# Altium project Isolator-Magnetic.PrjPcb
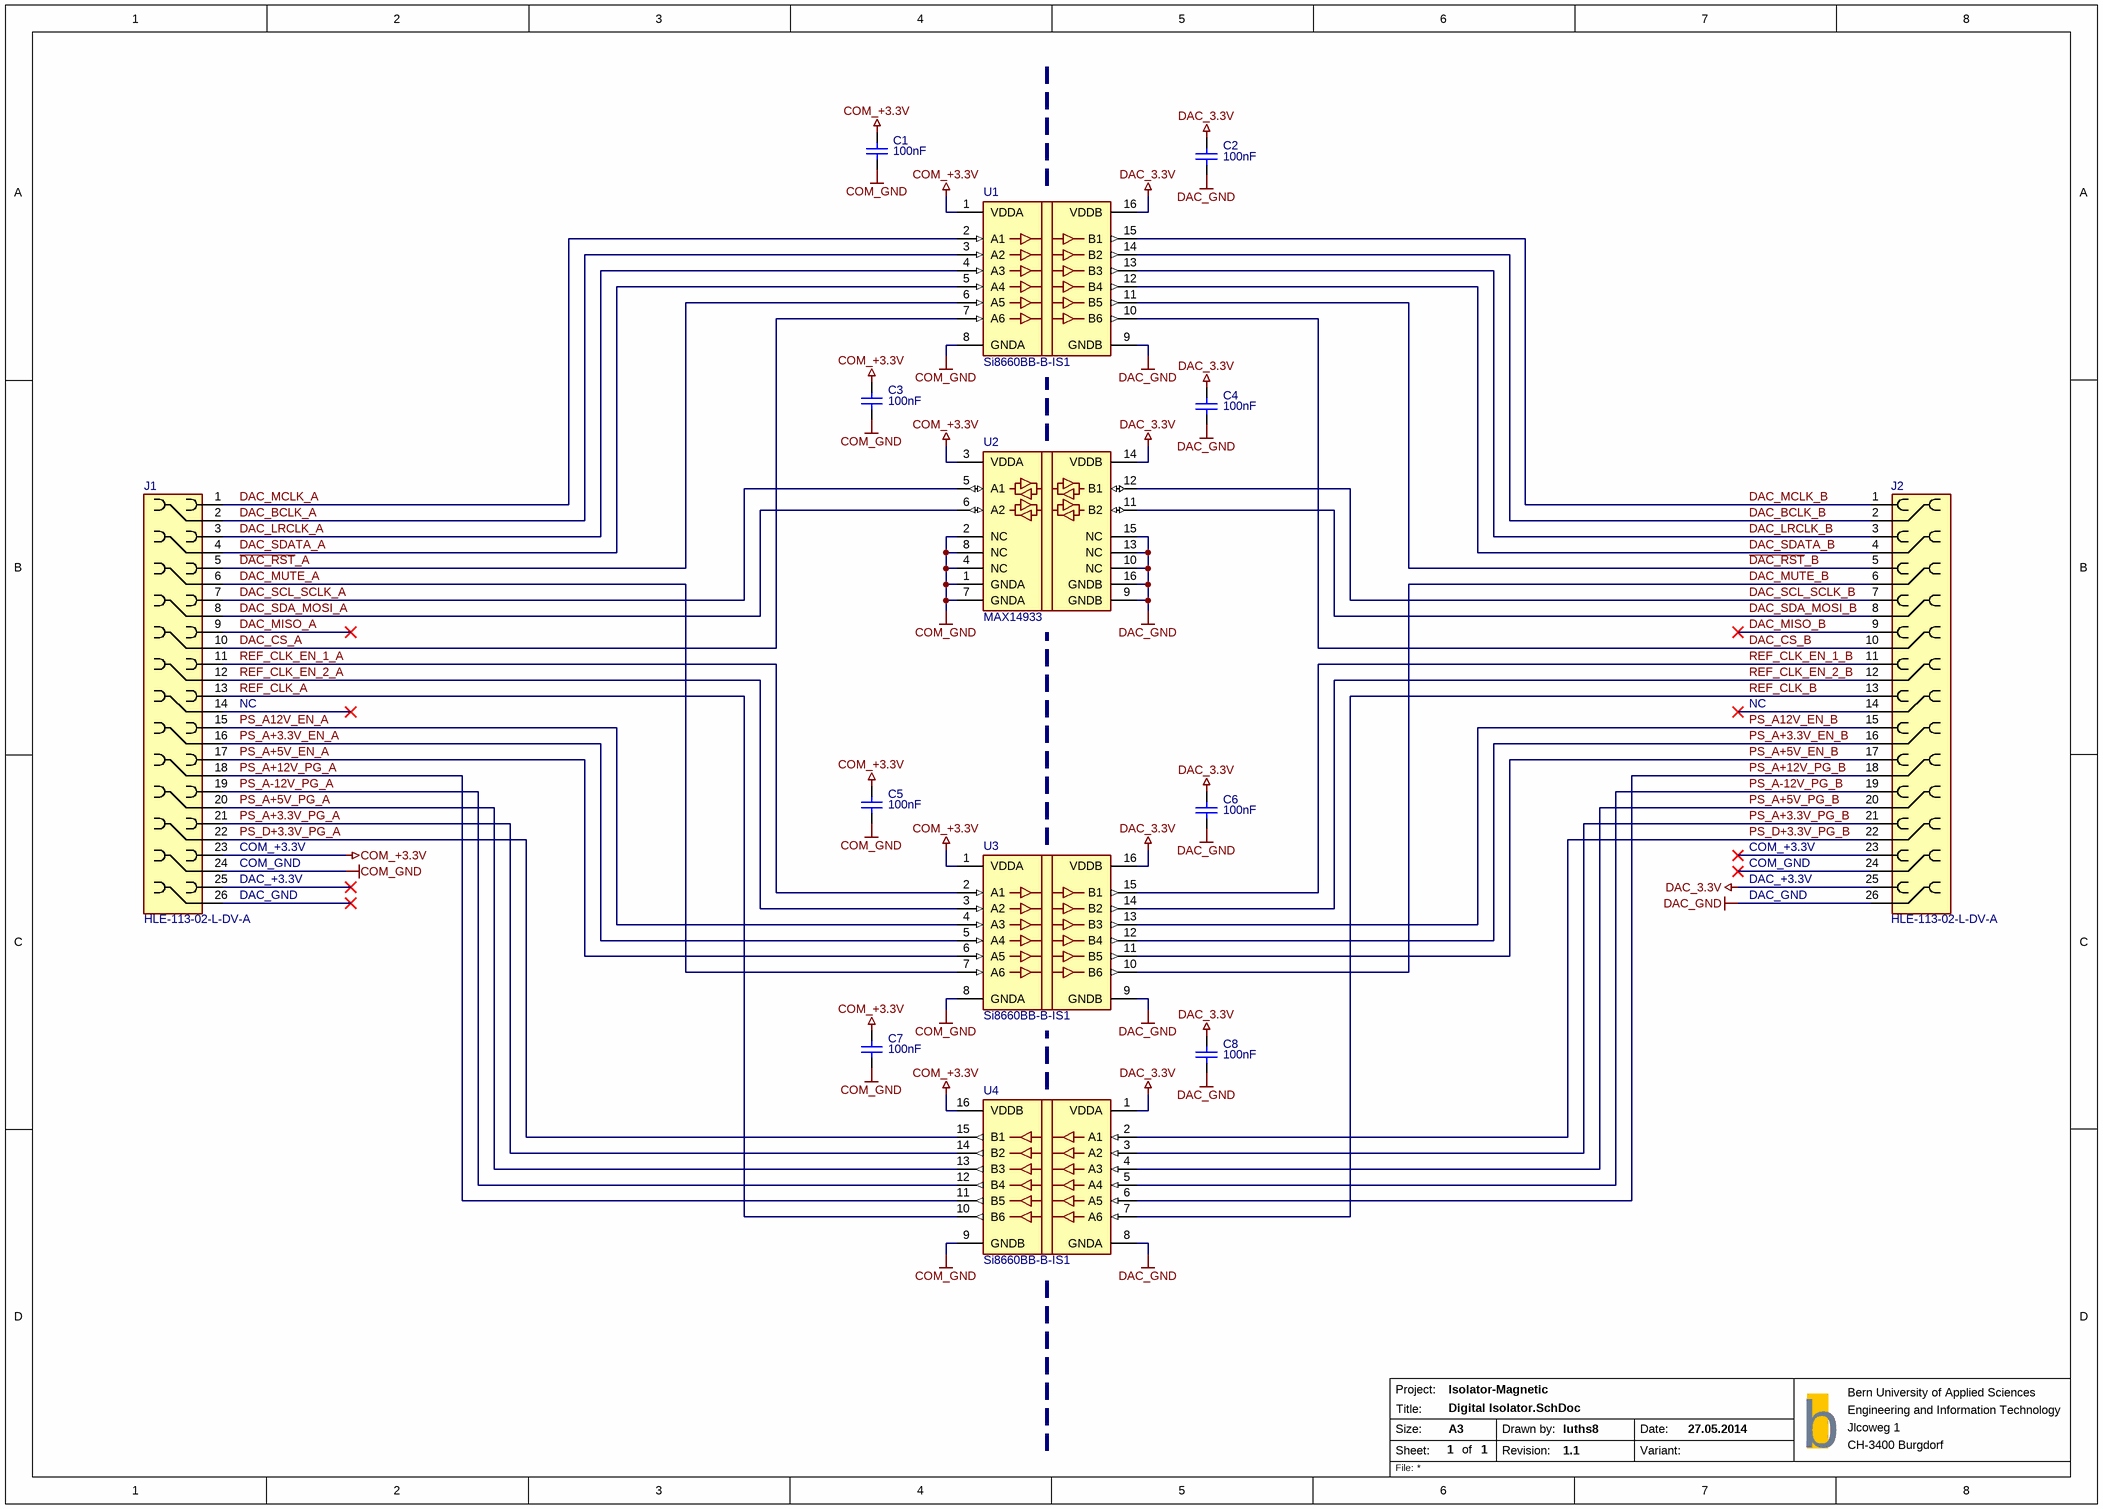
[diagram p0: Digital Isolator.SchDoc]
ProjectAuthors: Klossner, Lüthi; ProjectName: Isolator-Magnetic; Revision: 1.1
1 sheet, 14 parts. Net scope: hierarchical (ports join the sheet entries above them; power ports are global).
Board file: Isolator-Magnetic.PcbDoc

## Sheet Digital Isolator.SchDoc
size A3; Date: 27.05.2014; DrawnBy: luths8; Organization: BFH; Address1: Bern University of Applied Sciences; Address2: Engineering and Information Technology; Address3: Jlcoweg 1; Address4: CH-3400 Burgdorf; DocumentNumber: 1; Revision: 1.1; SheetNumber: 1; SheetTotal: 1; CurrentDate: 27.05.2014

### Parts
C1  100nF  [SMD0603CAP]
C2  100nF  [SMD0603CAP]
C3  100nF  [SMD0603CAP]
C4  100nF  [SMD0603CAP]
C5  100nF  [SMD0603CAP]
C6  100nF  [SMD0603CAP]
C7  100nF  [SMD0603CAP]
C8  100nF  [SMD0603CAP]
J1  HLE-113-02-L-DV-A  [HLE-113-02-XXX-DV-A]
J2  HLE-113-02-L-DV-A  [HLE-113-02-XXX-DV-A]
U1  Si8660BB-B-IS1  [SOIC16]
U2  MAX14933  [SOIC16]
U3  Si8660BB-B-IS1  [SOIC16]
U4  Si8660BB-B-IS1  [SOIC16]

### Nets
COM_+3.3V: C1.1 C3.1 C5.1 C7.1 J1.23 U1.1(VDDA) U2.3(VDDA) U3.1(VDDA) U4.16(VDDB)
COM_GND: C1.2(q) C3.2(q) C5.2(q) C7.2(q) J1.24 U1.8(GNDA) U2.1(GNDA) U2.2(NC) U2.4(NC) U2.7(GNDA) U2.8(NC) U3.8(GNDA) U4.9(GNDB)
DAC_3.3V: C2.1 C4.1 C6.1 C8.1 J2.25 U1.16(VDDB) U2.14(VDDB) U3.16(VDDB) U4.1(VDDA)
DAC_GND: C2.2(q) C4.2(q) C6.2(q) C8.2(q) J2.26 U1.9(GNDB) U2.9(GNDB) U2.10(NC) U2.13(NC) U2.15(NC) U2.16(GNDB) U3.9(GNDB) U4.8(GNDA)
~{DAC_RST}_A: J1.5 U1.6(A5)
~{DAC_RST}_B: J2.5 U1.11(B5)
DAC_BCLK_A: J1.2 U1.3(A2)
DAC_BCLK_B: J2.2 U1.14(B2)
DAC_CS_A: J1.10 U1.7(A6)
DAC_CS_B: J2.10 U1.10(B6)
DAC_LRCLK_A: J1.3 U1.4(A3)
DAC_LRCLK_B: J2.3 U1.13(B3)
DAC_MCLK_A: J1.1 U1.2(A1)
DAC_MCLK_B: J2.1 U1.15(B1)
DAC_MISO_A: J1.9
DAC_MISO_B: J2.9
DAC_MUTE_A: J1.6 U3.7(A6)
DAC_MUTE_B: J2.6 U3.10(B6)
DAC_SCL_SCLK_A: J1.7 U2.5(A1)
DAC_SCL_SCLK_B: J2.7 U2.12(B1)
DAC_SDA_MOSI_A: J1.8 U2.6(A2)
DAC_SDA_MOSI_B: J2.8 U2.11(B2)
DAC_SDATA_A: J1.4 U1.5(A4)
DAC_SDATA_B: J2.4 U1.12(B4)
PS_A12V_EN_A: J1.15 U3.4(A3)
PS_A12V_EN_B: J2.15 U3.13(B3)
PS_A+3.3V_EN_A: J1.16 U3.5(A4)
PS_A+3.3V_EN_B: J2.16 U3.12(B4)
PS_A+3.3V_PG_A: J1.21 U4.14(B2)
PS_A+3.3V_PG_B: J2.21 U4.3(A2)
PS_A+5V_EN_A: J1.17 U3.6(A5)
PS_A+5V_EN_B: J2.17 U3.11(B5)
PS_A+5V_PG_A: J1.20 U4.13(B3)
PS_A+5V_PG_B: J2.20 U4.4(A3)
PS_A+12V_PG_A: J1.18 U4.11(B5)
PS_A+12V_PG_B: J2.18 U4.6(A5)
PS_A-12V_PG_A: J1.19 U4.12(B4)
PS_A-12V_PG_B: J2.19 U4.5(A4)
PS_D+3.3V_PG_A: J1.22 U4.15(B1)
PS_D+3.3V_PG_B: J2.22 U4.2(A1)
REF_CLK_A: J1.13 U4.10(B6)
REF_CLK_B: J2.13 U4.7(A6)
REF_CLK_EN_1_A: J1.11 U3.2(A1)
REF_CLK_EN_1_B: J2.11 U3.15(B1)
REF_CLK_EN_2_A: J1.12 U3.3(A2)
REF_CLK_EN_2_B: J2.12 U3.14(B2)

Not connected (* = marked no-connect by the designer): J1 14* 25* 26*; J2 14* 23* 24*

### Notes on the sheet
- (near J1) NC
- NC
- (near J1) COM_+3.3V
- COM_+3.3V
- (near J1) DAC_GND
- (near J1) DAC_+3.3V
- (near J1) COM_GND
- DAC_GND
- DAC_+3.3V
- COM_GND
- Project:
- Size:
- Sheet:
- Title:
- A3
- of
- Drawn by:
- Revision:
- Date:
- Variant:
- b
- File:

### Library data of the parts
C1-C8 = Capacitor Ceramic: Ceramic Capacitor; Voltage: *; Manufacturer Part No.: *
J1 J2 = Receptacle 13x2P: Manufacturer Part No.: HLE-113-02-L-DV-A
U1 U3 U4 = Si8660BB-B-IS1: Unidirectional digital isolator; Manufacturer Part No.: Si8660BB-B-IS1
U2 = MAX14933: Bidirectional digital isolator; Manufacturer Part No.: MAX14933ASE+